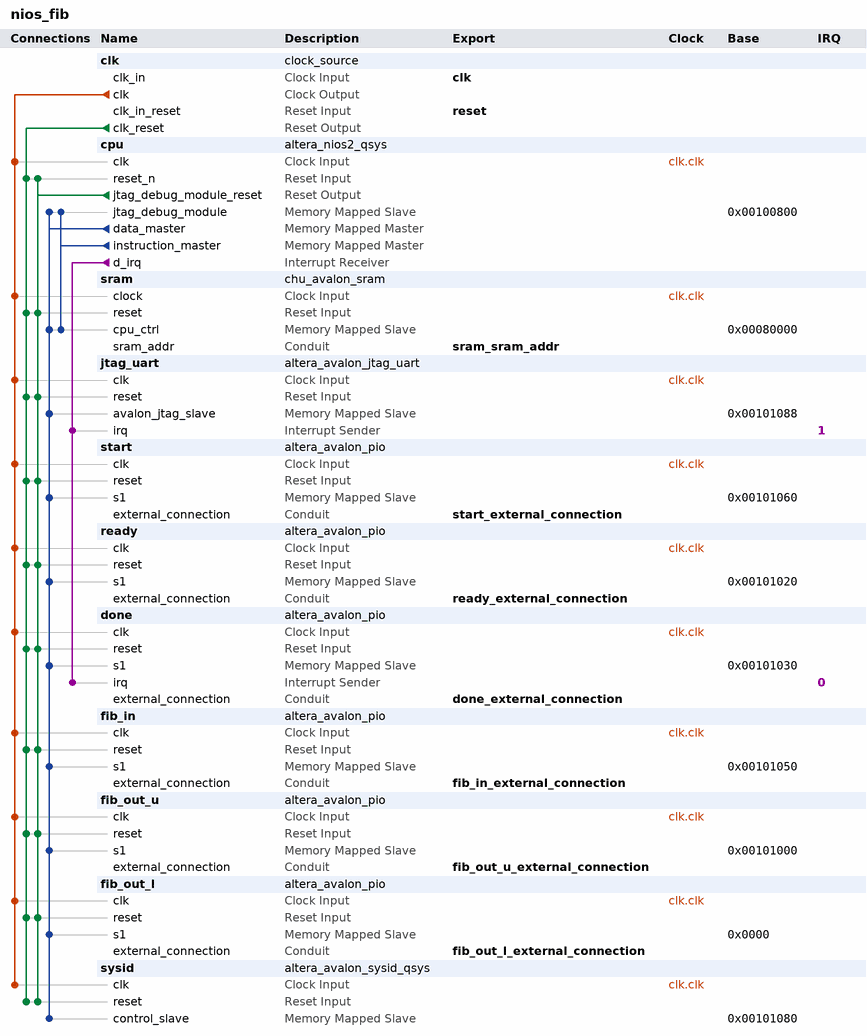
[diagram p0: system contents]
# Platform Designer (Qsys) system nios_fib, Cyclone IV GX Unknown
# Parameters at their usual value, and those the tool derives, are not listed.
package require -exact qsys 13.0.1.99.2
create_system nios_fib
set_project_property DEVICE_FAMILY {Cyclone IV GX}
set_project_property DEVICE Unknown

add_instance clk clock_source 13.0
set_instance_parameter_value clk clockFrequency 50000000

add_instance cpu altera_nios2_qsys 13.0
set_instance_parameter_value cpu resetSlave sram.cpu_ctrl
set_instance_parameter_value cpu mmu_TLBMissExcSlave None
set_instance_parameter_value cpu exceptionSlave sram.cpu_ctrl
set_instance_parameter_value cpu breakSlave cpu.jtag_debug_module
set_instance_parameter_value cpu impl Tiny
set_instance_parameter_value cpu icache_size 4096

add_instance sram chu_avalon_sram 1.0

add_instance jtag_uart altera_avalon_jtag_uart 13.0.1.99.2
set_instance_parameter_value jtag_uart simInteractiveOptions NO_INTERACTIVE_WINDOWS

add_instance start altera_avalon_pio 13.0.1.99.2
set_instance_parameter_value start direction Output
set_instance_parameter_value start width 1

add_instance ready altera_avalon_pio 13.0.1.99.2
set_instance_parameter_value ready direction Input
set_instance_parameter_value ready width 1

add_instance done altera_avalon_pio 13.0.1.99.2
set_instance_parameter_value done captureEdge true
set_instance_parameter_value done direction Input
set_instance_parameter_value done generateIRQ true
set_instance_parameter_value done irqType EDGE
set_instance_parameter_value done width 1

add_instance fib_in altera_avalon_pio 13.0.1.99.2
set_instance_parameter_value fib_in direction Output
set_instance_parameter_value fib_in width 8

add_instance fib_out_u altera_avalon_pio 13.0.1.99.2
set_instance_parameter_value fib_out_u direction Input
set_instance_parameter_value fib_out_u width 32

add_instance fib_out_l altera_avalon_pio 13.0.1.99.2
set_instance_parameter_value fib_out_l direction Input
set_instance_parameter_value fib_out_l width 32

add_instance sysid altera_avalon_sysid_qsys 13.0
set_instance_parameter_value sysid id 0

# connections
add_connection clk.clk cpu.clk clock
add_connection clk.clk done.clk clock
add_connection clk.clk fib_in.clk clock
add_connection clk.clk fib_out_l.clk clock
add_connection clk.clk fib_out_u.clk clock
add_connection clk.clk jtag_uart.clk clock
add_connection clk.clk ready.clk clock
add_connection clk.clk sram.clock clock
add_connection clk.clk start.clk clock
add_connection clk.clk sysid.clk clock
add_connection clk.clk_reset cpu.reset_n reset
add_connection clk.clk_reset done.reset reset
add_connection clk.clk_reset fib_in.reset reset
add_connection clk.clk_reset fib_out_l.reset reset
add_connection clk.clk_reset fib_out_u.reset reset
add_connection clk.clk_reset jtag_uart.reset reset
add_connection clk.clk_reset ready.reset reset
add_connection clk.clk_reset sram.reset reset
add_connection clk.clk_reset start.reset reset
add_connection clk.clk_reset sysid.reset reset
add_connection cpu.jtag_debug_module_reset cpu.reset_n reset
add_connection cpu.jtag_debug_module_reset done.reset reset
add_connection cpu.jtag_debug_module_reset fib_in.reset reset
add_connection cpu.jtag_debug_module_reset fib_out_l.reset reset
add_connection cpu.jtag_debug_module_reset fib_out_u.reset reset
add_connection cpu.jtag_debug_module_reset jtag_uart.reset reset
add_connection cpu.jtag_debug_module_reset ready.reset reset
add_connection cpu.jtag_debug_module_reset sram.reset reset
add_connection cpu.jtag_debug_module_reset start.reset reset
add_connection cpu.jtag_debug_module_reset sysid.reset reset
add_connection cpu.data_master cpu.jtag_debug_module avalon
set_connection_parameter_value cpu.data_master/cpu.jtag_debug_module baseAddress 0x00100800
add_connection cpu.data_master done.s1 avalon
set_connection_parameter_value cpu.data_master/done.s1 baseAddress 0x00101030
add_connection cpu.data_master fib_in.s1 avalon
set_connection_parameter_value cpu.data_master/fib_in.s1 baseAddress 0x00101050
add_connection cpu.data_master fib_out_l.s1 avalon
set_connection_parameter_value cpu.data_master/fib_out_l.s1 baseAddress 0x0000
add_connection cpu.data_master fib_out_u.s1 avalon
set_connection_parameter_value cpu.data_master/fib_out_u.s1 baseAddress 0x00101000
add_connection cpu.data_master jtag_uart.avalon_jtag_slave avalon
set_connection_parameter_value cpu.data_master/jtag_uart.avalon_jtag_slave baseAddress 0x00101088
add_connection cpu.data_master ready.s1 avalon
set_connection_parameter_value cpu.data_master/ready.s1 baseAddress 0x00101020
add_connection cpu.data_master sram.cpu_ctrl avalon
set_connection_parameter_value cpu.data_master/sram.cpu_ctrl baseAddress 0x00080000
add_connection cpu.data_master start.s1 avalon
set_connection_parameter_value cpu.data_master/start.s1 baseAddress 0x00101060
add_connection cpu.data_master sysid.control_slave avalon
set_connection_parameter_value cpu.data_master/sysid.control_slave baseAddress 0x00101080
add_connection cpu.instruction_master cpu.jtag_debug_module avalon
set_connection_parameter_value cpu.instruction_master/cpu.jtag_debug_module baseAddress 0x00100800
add_connection cpu.instruction_master sram.cpu_ctrl avalon
set_connection_parameter_value cpu.instruction_master/sram.cpu_ctrl baseAddress 0x00080000
add_connection cpu.d_irq done.irq interrupt
set_connection_parameter_value cpu.d_irq/done.irq irqNumber 0
add_connection cpu.d_irq jtag_uart.irq interrupt
set_connection_parameter_value cpu.d_irq/jtag_uart.irq irqNumber 1

# exported interfaces
add_interface clk clock sink
set_interface_property clk EXPORT_OF clk.clk_in
add_interface reset reset sink
set_interface_property reset EXPORT_OF clk.clk_in_reset
add_interface sram_sram_addr conduit end
set_interface_property sram_sram_addr EXPORT_OF sram.sram_addr
add_interface start_external_connection conduit end
set_interface_property start_external_connection EXPORT_OF start.external_connection
add_interface done_external_connection conduit end
set_interface_property done_external_connection EXPORT_OF done.external_connection
add_interface ready_external_connection conduit end
set_interface_property ready_external_connection EXPORT_OF ready.external_connection
add_interface fib_in_external_connection conduit end
set_interface_property fib_in_external_connection EXPORT_OF fib_in.external_connection
add_interface fib_out_u_external_connection conduit end
set_interface_property fib_out_u_external_connection EXPORT_OF fib_out_u.external_connection
add_interface fib_out_l_external_connection conduit end
set_interface_property fib_out_l_external_connection EXPORT_OF fib_out_l.external_connection

set_interconnect_requirement {$system} qsys_mm.clockCrossingAdapter HANDSHAKE
set_interconnect_requirement {$system} qsys_mm.maxAdditionalLatency 1

save_system nios_fib.qsys
